# EAGLE design Rev A (EAGLE 6.5.0)

## Sheet 1 of 2: Amplifier
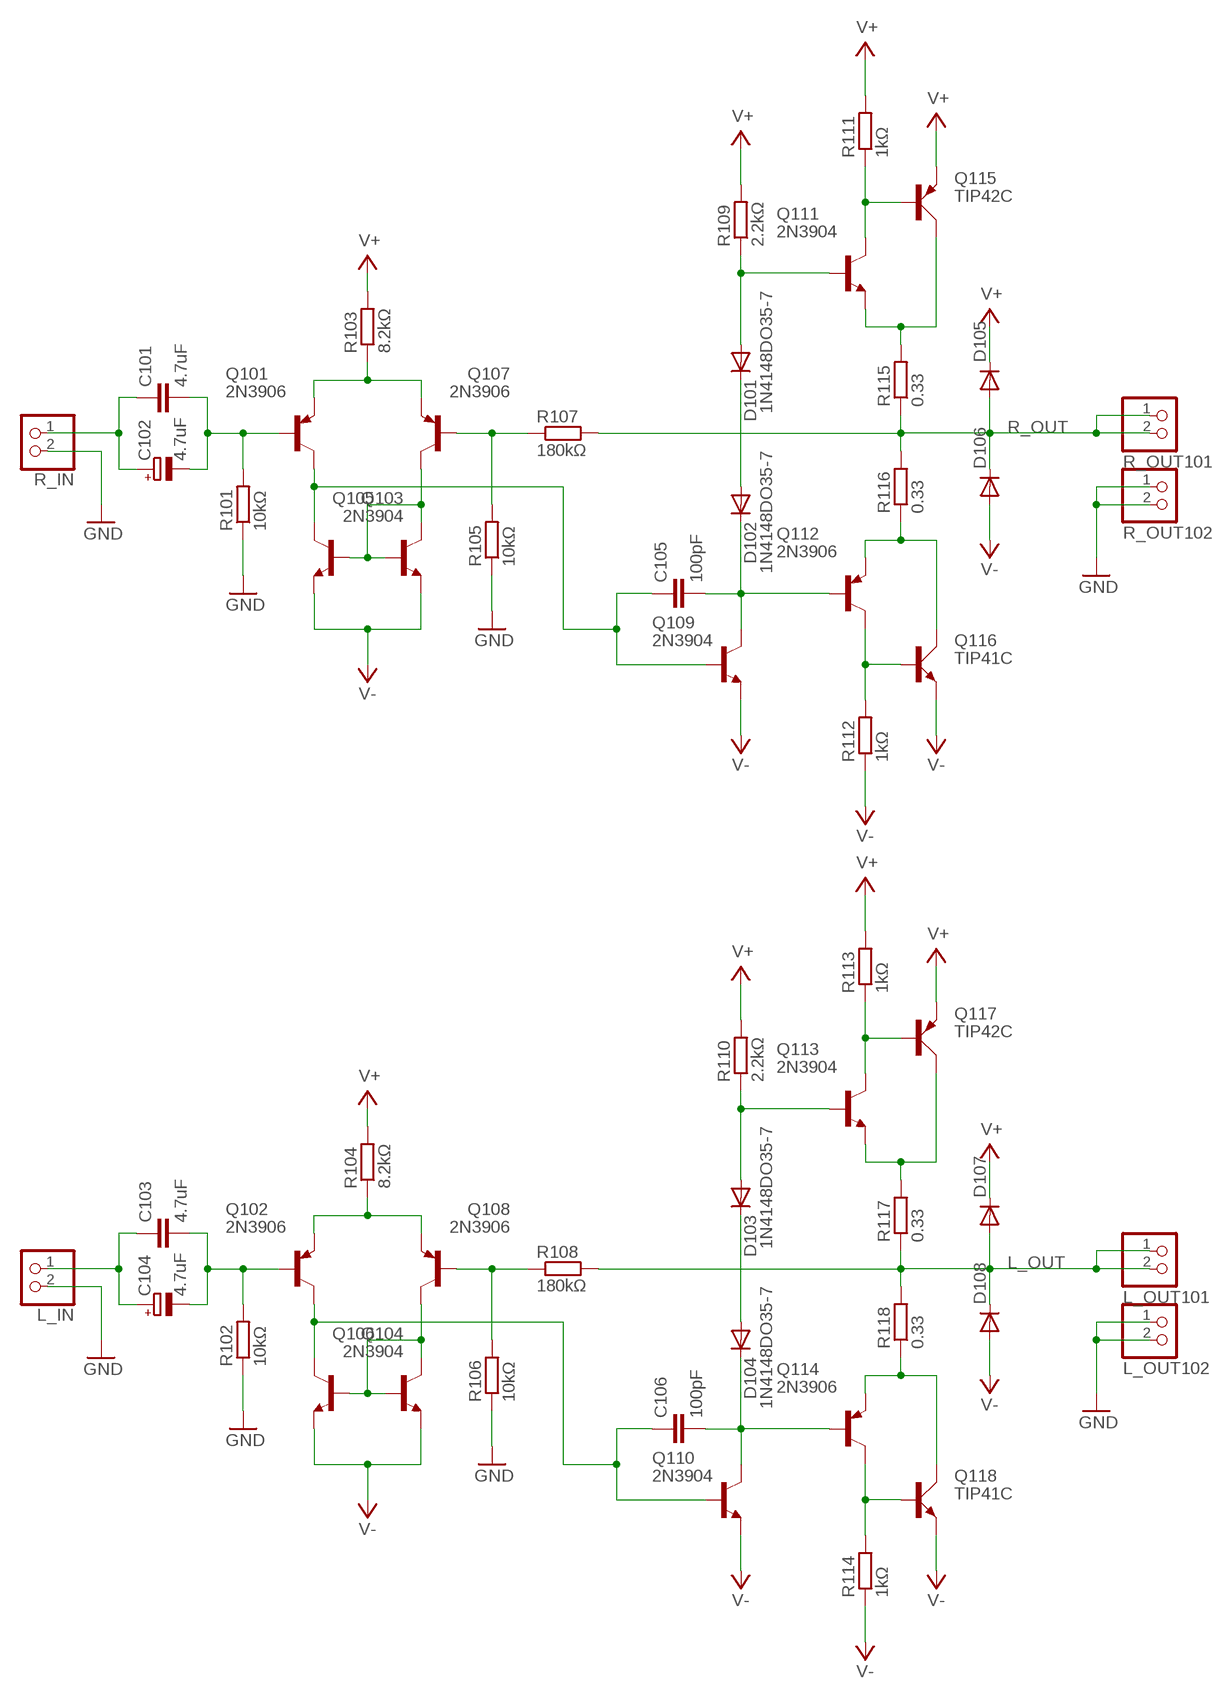
[diagram p0: schematic, sheet 1]

### Parts
C101  4.7uF  C-EU225-113X268  [C225-113X268]
C102  4.7uF  CPOL-EUE2-5  [E2-5]
C103  4.7uF  C-EU225-113X268  [C225-113X268]
C104  4.7uF  CPOL-EUE2-5  [E2-5]
C105  100pF  C-EU050-050X075  [C050-050X075]
C106  100pF  C-EU050-050X075  [C050-050X075]
D101  1N4148DO35-7  [DO35-7]
D102  1N4148DO35-7  [DO35-7]
D103  1N4148DO35-7  [DO35-7]
D104  1N4148DO35-7  [DO35-7]
D105  1N4148DO35-7  [DO35-7]
D106  1N4148DO35-7  [DO35-7]
D107  1N4148DO35-7  [DO35-7]
D108  1N4148DO35-7  [DO35-7]
L_IN  JST_2PIN-THM  [JST-PH-2-THM]
L_OUT101  JST_2PIN-THM  [JST-PH-2-THM]
L_OUT102  JST_2PIN-THM  [JST-PH-2-THM]
Q101  2N3906  [TO92]
Q102  2N3906  [TO92]
Q103  2N3904  [TO92]
Q104  2N3904  [TO92]
Q105  2N3904  [TO92]
Q106  2N3904  [TO92]
Q107  2N3906  [TO92]
Q108  2N3906  [TO92]
Q109  2N3904  [TO92]
Q110  2N3904  [TO92]
Q111  2N3904  [TO92]
Q112  2N3906  [TO92]
Q113  2N3904  [TO92]
Q114  2N3906  [TO92]
Q115  TIP42C  [TO220AV]
Q116  TIP41C  [TO220AV]
Q117  TIP42C  [TO220AV]
Q118  TIP41C  [TO220AV]
R101  10kΩ  R-EU_0207/10  [0207/10]
R102  10kΩ  R-EU_0207/10  [0207/10]
R103  8.2kΩ  R-EU_0207/10  [0207/10]
R104  8.2kΩ  R-EU_0207/10  [0207/10]
R105  10kΩ  R-EU_0207/10  [0207/10]
R106  10kΩ  R-EU_0207/10  [0207/10]
R107  180kΩ  R-EU_0207/10  [0207/10]
R108  180kΩ  R-EU_0207/10  [0207/10]
R109  2.2kΩ  R-EU_0207/10  [0207/10]
R110  2.2kΩ  R-EU_0207/10  [0207/10]
R111  1kΩ  R-EU_0207/10  [0207/10]
R112  1kΩ  R-EU_0207/10  [0207/10]
R113  1kΩ  R-EU_0207/10  [0207/10]
R114  1kΩ  R-EU_0207/10  [0207/10]
R115  0.33  R-EU_0414/15  [0414/15]
R116  0.33  R-EU_0414/15  [0414/15]
R117  0.33  R-EU_0414/15  [0414/15]
R118  0.33  R-EU_0414/15  [0414/15]
R_IN  JST_2PIN-THM  [JST-PH-2-THM]
R_OUT101  JST_2PIN-THM  [JST-PH-2-THM]
R_OUT102  JST_2PIN-THM  [JST-PH-2-THM]

### Nets
GND: L_IN.2 L_OUT102.1 L_OUT102.2 R101.1 R102.1 R105.1 R106.1 R_IN.2 R_OUT102.1 R_OUT102.2 ; also sheet 2
L_OUT: D107.A D108.C L_OUT101.1 L_OUT101.2 R108.2 R117.1 R118.2
N$1: D101.A Q111.2(B) R109.1
N$2: Q101.3(E) Q107.3(E) R103.1
N$3: Q103.2(B) Q105.1(C) Q105.2(B) Q107.1(C)
N$4: Q104.2(B) Q106.1(C) Q106.2(B) Q108.1(C)
N$5: C101.2 C102.- Q101.2(B) R101.2
N$6: C101.1 C102.+ R_IN.1
N$8: C105.1 Q101.1(C) Q103.1(C) Q109.2(B)
N$24: D101.C D102.A
N$25: C103.2 C104.- Q102.2(B) R102.2
N$26: Q111.1(C) Q115.B R111.1
N$27: Q112.1(C) Q116.B R112.2
N$28: Q112.3(E) Q116.C R116.1
N$29: Q111.3(E) Q115.C R115.2
N$30: C103.1 C104.+ L_IN.1
N$31: C105.2 D102.C Q109.1(C) Q112.2(B)
N$32: Q107.2(B) R105.2 R107.1
N$33: Q102.3(E) Q108.3(E) R104.1
N$34: C106.1 Q102.1(C) Q104.1(C) Q110.2(B)
N$35: D103.C D104.A
N$36: D103.A Q113.2(B) R110.1
N$37: Q113.1(C) Q117.B R113.1
N$38: Q113.3(E) Q117.C R117.2
N$39: Q114.1(C) Q118.B R114.2
N$40: Q114.3(E) Q118.C R118.1
N$41: C106.2 D104.C Q110.1(C) Q114.2(B)
N$42: Q108.2(B) R106.2 R108.1
R_OUT: D105.A D106.C R107.2 R115.1 R116.2 R_OUT101.1 R_OUT101.2
V+: D105.C D107.C Q115.E Q117.E R103.2 R104.2 R109.2 R110.2 R111.2 R113.2 ; also sheet 2
V-: D106.A D108.A Q103.3(E) Q104.3(E) Q105.3(E) Q106.3(E) Q109.3(E) Q110.3(E) Q116.E Q118.E R112.1 R114.1 ; also sheet 2

## Sheet 2 of 2: Power Supply
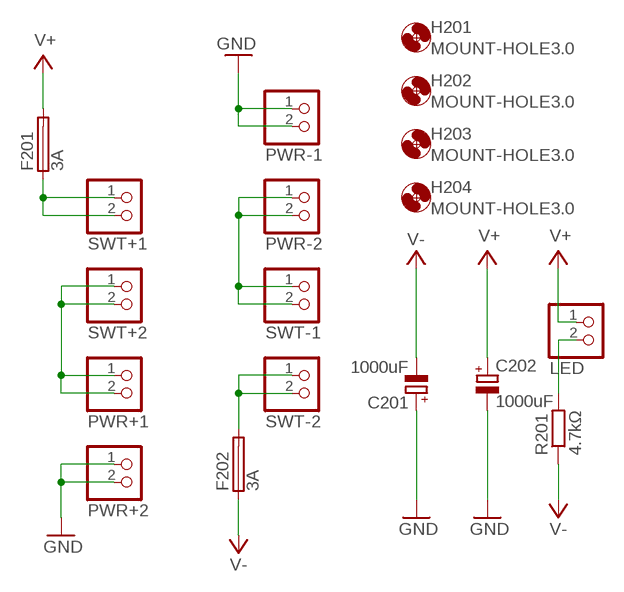
[diagram p1: schematic, sheet 2]

### Parts
C201  1000uF  CPOL-EUE5-10.5  [E5-10,5]
C202  1000uF  CPOL-EUE5-10.5  [E5-10,5]
F201  3A  SH22,5  [SH22,5]
F202  3A  SH22,5  [SH22,5]
H201  MOUNT-HOLE3.0  [3,0]
H202  MOUNT-HOLE3.0  [3,0]
H203  MOUNT-HOLE3.0  [3,0]
H204  MOUNT-HOLE3.0  [3,0]
LED  JST_2PIN-THM  [JST-PH-2-THM]
PWR+1  JST_2PIN-THM  [JST-PH-2-THM]
PWR+2  JST_2PIN-THM  [JST-PH-2-THM]
PWR-1  JST_2PIN-THM  [JST-PH-2-THM]
PWR-2  JST_2PIN-THM  [JST-PH-2-THM]
R201  4.7kΩ  R-EU_0207/10  [0207/10]
SWT+1  JST_2PIN-THM  [JST-PH-2-THM]
SWT+2  JST_2PIN-THM  [JST-PH-2-THM]
SWT-1  JST_2PIN-THM  [JST-PH-2-THM]
SWT-2  JST_2PIN-THM  [JST-PH-2-THM]

### Nets
GND: C201.+ C202.- PWR+2.1 PWR+2.2 PWR-1.1 PWR-1.2 ; also sheet 1
N$22: LED.2 R201.2
N$43: PWR+1.1 PWR+1.2 SWT+2.1 SWT+2.2
N$44: PWR-2.1 PWR-2.2 SWT-1.1 SWT-1.2
N$45: F202.2 SWT-2.1 SWT-2.2
N$47: F201.1 SWT+1.1 SWT+1.2
V+: C202.+ F201.2 LED.1 ; also sheet 1
V-: C201.- F202.1 R201.1 ; also sheet 1

## Library data of the parts
C101 C103 C105 C106 = rcl:C-EU: CAPACITOR, European symbol
C102 C104 C201 C202 = rcl:CPOL-EU: POLARIZED CAPACITOR, European symbol
D101-D108 = diode:1N4148: DIODE high speed (Philips)
F201 F202 = fuse:SH22,5: FUSE HOLDER grid 22,5 mm, OGN0031 8201, Schurter (Buerklin); MF: SCHURTER; MPN: 0031.8201; OC_FARNELL: 1162740; OC_NEWARK: 96F8317
H201-H204 = holes:MOUNT-HOLE: MOUNTING HOLE with drill center marker
L_IN L_OUT101 L_OUT102 LED PWR+1 PWR+2 PWR-1 PWR-2 R_IN R_OUT101 R_OUT102 SWT+1 SWT+2 SWT-1 SWT-2 = adafruit:JST_2PIN: JST 2-Pin Connectors of various flavors SMT-RA (S2B-PH-SM4) 4UConnector #17311 SMT (B2B-PH-SM4) THM-RA (S2B-PH) THM (B2B-PH)
Q101 Q102 Q107 Q108 Q112 Q114 = transistor-pnp:2N3906: PNP Transistor
Q103-Q106 Q109-Q111 Q113 = transistor-npn:2N3904: NPN Transistor
Q115 Q117 = transistor-power:TIP42C: PNP TRANSISTOR
Q116 Q118 = transistor-power:TIP41C: NPN TRANSISTOR
R101-R118 R201 = rcl:R-EU_: RESISTOR, European symbol

## Board
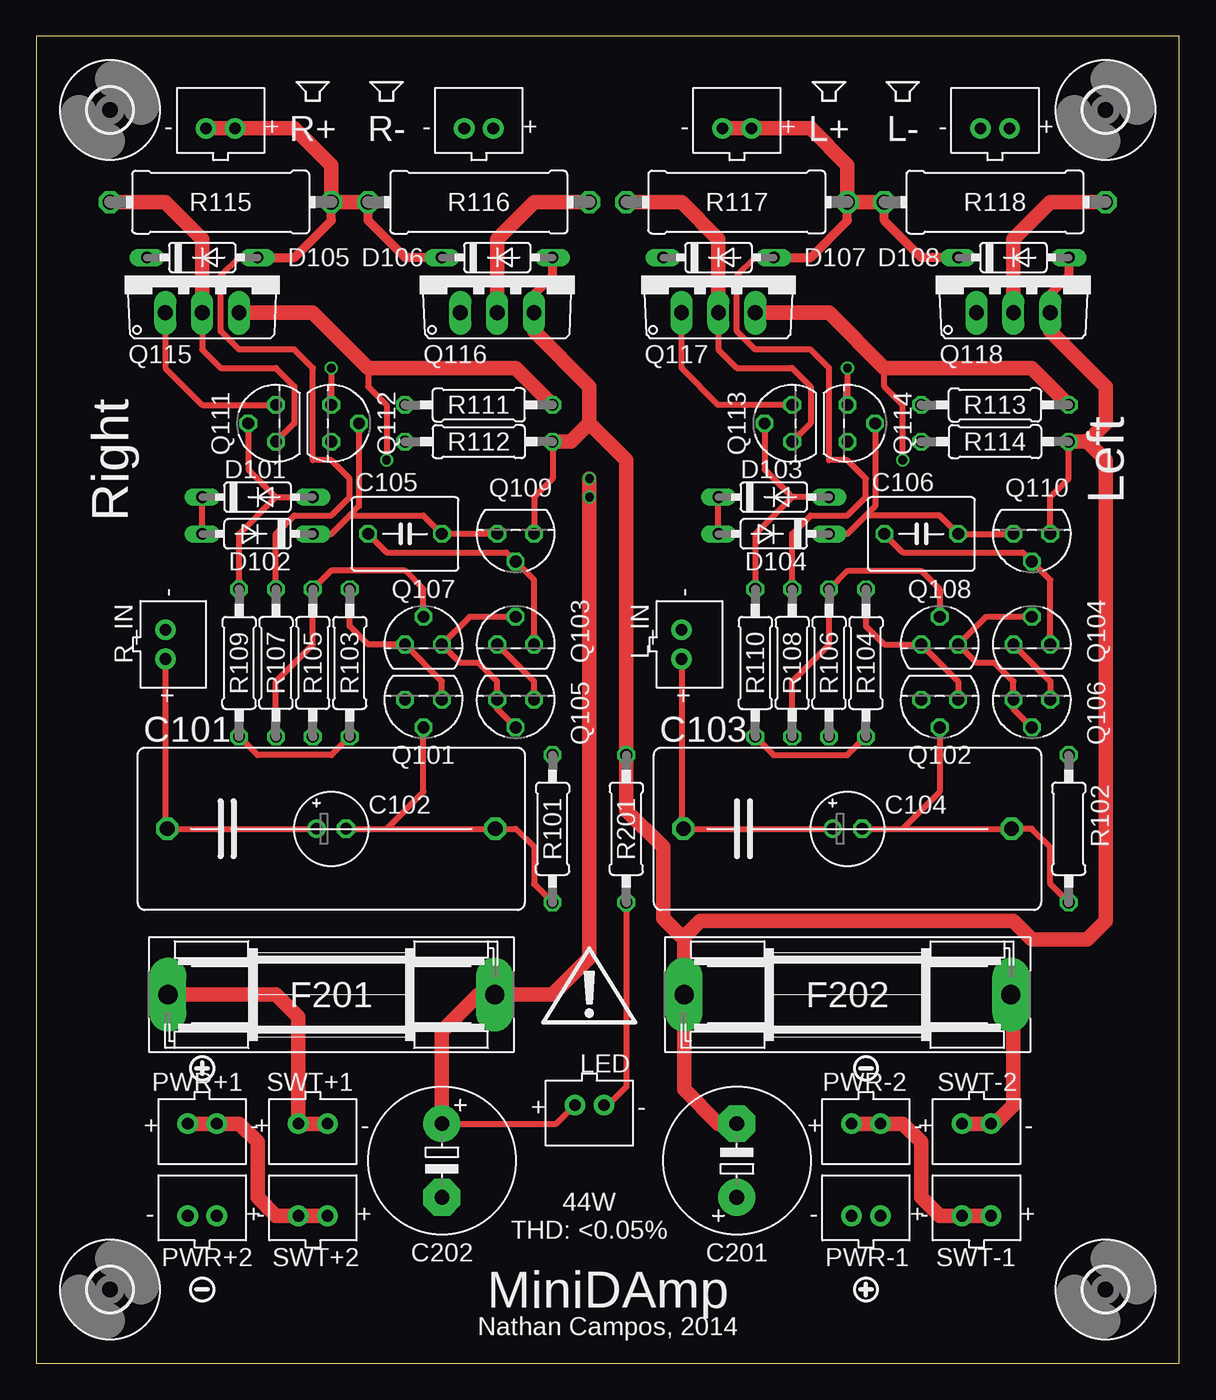
[diagram p2: board, top side]
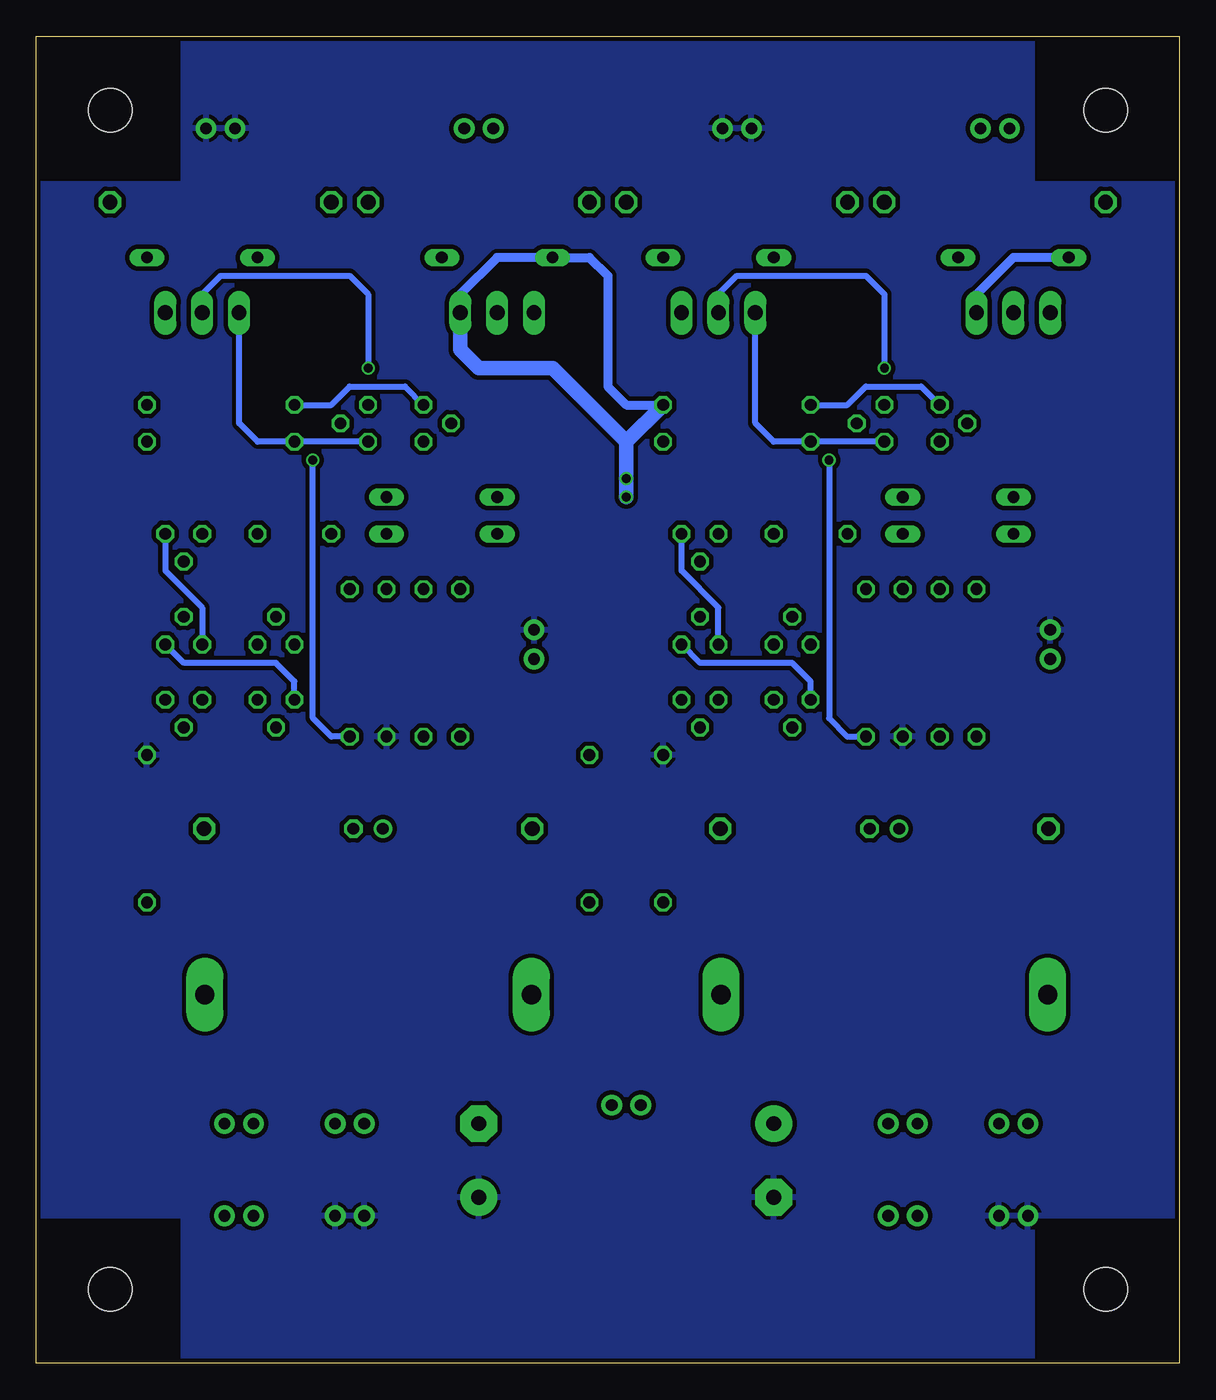
[diagram p3: board, bottom side, seen from below]

Size 78.74 x 91.44 mm. Coordinates in mm from the lower left corner, seen from the top.
Outline: 0,0 78.74,0 78.74,91.44 0,91.44 0,0
Copper layers (1*2*15*16): Top 0.035mm / dielectric 0.2mm / Route2 0.0175mm / dielectric 1.1mm / Route15 0.0175mm / dielectric 0.2mm / Bottom 0.035mm
Design rules "SeeedStudio_DRU_no_angle_20130527": minimum track width 6mil, minimum drill 12mil, track to track 6mil, track to pad 6mil, pad to pad 6mil, via to via 6mil, smd to smd 0mil, copper to edge 10mil, drill to drill 10mil, minimum pad ring 6mil, minimum via ring 6mil, stop-mask expansion 2mil, vias tented up to drill 25mil, thermal gap 10mil

### Footprints (pad centres in the part's own frame; a part is rotated, then mirrored left to right if it is on the bottom)
C225-113X268 = drill 1.016 octagon: 1 -11.303,0; 2 11.303,0
E2-5 = drill 0.813 pad 1.27: + -1.016,0 | drill 0.813 pad 1.27 octagon: - 1.016,0
C050-050X075 = drill 0.813 octagon: 1 -2.54,0; 2 2.54,0
E5-10,5 = drill 1.016 pad 2.54: + -2.54,0 | drill 1.016 pad 2.54 octagon: - 2.54,0
DO35-7 = drill 0.813 long: A 3.81,0; C -3.81,0
SH22,5 = drill 1.321 pad 2.54 long: 1 -11.252,0; 2 11.252,0
3,0 = hole 3: 0,0
JST-PH-2-THM = drill 0.8 pad 1.422: 1 1,0; 2 -1,0
TO92 = drill 0.813 octagon: 1 1.27,0; 2 0,1.905; 3 -1.27,0
TO220AV = drill 1.016 long: B -2.54,-2.54; C 0,-2.54; E 2.54,-2.54
0207/10 = drill 0.813 octagon: 1 -5.08,0; 2 5.08,0
0414/15 = drill 1.016 octagon: 1 -7.62,0; 2 7.62,0

### Placement (x,y rotation side)
C101  20.32,36.83 0 top
C102  20.32,36.83 0 top
C103  55.88,36.83 0 top
C104  55.88,36.83 0 top
C105  25.4,57.15 0 top
C106  60.96,57.15 0 top
C201  48.26,13.97 90 top
C202  27.94,13.97 270 top
D101  15.24,59.69 0 top
D102  15.24,57.15 180 top
D103  50.8,59.69 0 top
D104  50.8,57.15 180 top
D105  11.43,76.2 0 top
D106  31.75,76.2 0 top
D107  46.99,76.2 0 top
D108  67.31,76.2 0 top
F201  20.32,25.4 0 top
F202  55.88,25.4 0 top
H201  5.08,86.36 0 top
H202  5.08,5.08 0 top
H203  73.66,86.36 0 top
H204  73.66,5.08 0 top
L_IN  44.45,49.53 270 top
L_OUT101  48.26,85.09 0 top
L_OUT102  66.04,85.09 0 top
LED  38.1,17.78 180 top
PWR+1  11.43,16.51 180 top
PWR+2  11.43,10.16 0 top
PWR-1  57.15,10.16 0 top
PWR-2  57.15,16.51 180 top
Q101  26.67,45.72 180 top
Q102  62.23,45.72 180 top
Q103  33.02,49.53 0 top
Q104  68.58,49.53 0 top
Q105  33.02,45.72 180 top
Q106  68.58,45.72 180 top
Q107  26.67,49.53 0 top
Q108  62.23,49.53 0 top
Q109  33.02,57.15 180 top
Q110  68.58,57.15 180 top
Q111  16.51,64.77 90 top
Q112  20.32,64.77 270 top
Q113  52.07,64.77 90 top
Q114  55.88,64.77 270 top
Q115  11.43,74.93 0 top
Q116  31.75,74.93 0 top
Q117  46.99,74.93 0 top
Q118  67.31,74.93 0 top
R101  35.56,36.83 270 top
R102  71.12,36.83 270 top
R103  21.59,48.26 270 top
R104  57.15,48.26 270 top
R105  19.05,48.26 90 top
R106  54.61,48.26 90 top
R107  16.51,48.26 90 top
R108  52.07,48.26 90 top
R109  13.97,48.26 270 top
R110  49.53,48.26 270 top
R111  30.48,66.04 0 top
R112  30.48,63.5 180 top
R113  66.04,66.04 0 top
R114  66.04,63.5 180 top
R115  12.7,80.01 180 top
R116  30.48,80.01 180 top
R117  48.26,80.01 180 top
R118  66.04,80.01 180 top
R201  40.64,36.83 270 top
R_IN  8.89,49.53 270 top
R_OUT101  12.7,85.09 0 top
R_OUT102  30.48,85.09 0 top
SWT+1  19.05,16.51 180 top
SWT+2  19.05,10.16 0 top
SWT-1  64.77,10.16 0 top
SWT-2  64.77,16.51 180 top
U$1  [ICON_EXL-S]  38.1,25.4 0 top
U$2  [ICON_MINUS]  11.43,5.08 0 top
U$3  [ICON_MINUS]  57.15,20.32 0 top
U$4  [ICON_PLUS]  11.43,20.32 0 top
U$5  [ICON_PLUS]  57.15,5.08 0 top
U$6  [ICON_SPEAKER]  19.05,87.63 90 top
U$7  [ICON_SPEAKER]  24.13,87.63 90 top
U$8  [ICON_SPEAKER]  54.61,87.63 90 top
U$9  [ICON_SPEAKER]  59.69,87.63 90 top

### Tracks (layer width: path | path; a pad name or v marks a point on that pad's centre or on a via)
GND
  pour Bottom (isolate 0.305): 10.16,91.44 10.16,81.28 0,81.28 0,10.16 10.16,10.16 10.16,0 68.58,0 68.58,10.16 78.74,10.16 78.74,81.28 68.58,81.28 68.58,91.44
L_OUT
  Top 0.406: R108.2 52.07,57.15 53.34,58.42 55.88,58.42 57.15,59.69 57.15,60.96 55.88,62.23 54.61,62.23 54.61,68.58 53.34,69.85 49.53,69.85 48.26,71.12 48.26,74.93 49.53,76.2 D107.A
  Top 0.61: D107.A 53.34,76.2 55.88,78.74 R117.1 | D108.C 60.96,76.2 58.42,78.74 R118.2
  Top 1.016: R118.2 R117.1 55.88,82.55 53.34,85.09 L_OUT101.1 L_OUT101.2
N$1
  Top 0.406: R109.1 13.97,57.15 16.51,59.69 | 16.51,59.69 D101.A | Q111.2 14.61,61.59 16.51,59.69
N$2
  Top 0.406: Q101.3 27.94,46.99 Q107.3 22.86,49.53 21.59,50.8 R103.1
N$3
  Top 0.406: Q105.2 31.75,45.09 Q105.1 31.75,46.99 30.48,48.26 29.21,48.26 Q107.1 29.84,51.44 Q103.2
N$4
  Top 0.406: Q106.2 67.31,45.09 Q106.1 67.31,46.99 66.04,48.26 64.77,48.26 Q108.1 65.41,51.44 Q104.2
N$5
  Top 0.406: R101.2 34.29,33.02 34.29,35.56 33.02,36.83 C101.2 C102.- 24.13,36.83 26.67,39.37 Q101.2
N$6
  Top 0.406: C102.+ C101.1 8.89,36.96 R_IN.1
N$8
  Top 0.406: C105.1 24.13,55.88 32.38,55.88 Q109.2 34.29,53.98 Q103.1
  Bottom 0.406: Q101.1 25.4,46.99 26.67,48.26 33.02,48.26 Q103.1
N$22
  Top 0.406: R201.2 40.64,19.05 39.37,17.78 LED.2
N$24
  Top 0.406: D102.A D101.C
N$25
  Top 0.406: C104.- 59.69,36.83 | 59.69,36.83 C103.2 68.58,36.83 69.85,35.56 69.85,33.02 R102.2 | Q102.2 62.23,39.37 59.69,36.83
N$26
  Top 0.406: Q115.B 8.89,68.58 11.43,66.04 Q111.1
  Bottom 0.406: R111.1 22.86,66.04 21.59,67.31 17.78,67.31 Q111.1
N$27
  Bottom 0.406: Q112.1 R112.2 27.94,63.5 29.21,64.77 Q116.B
N$28  (via drill 0.6)
  Top 0.406: v20.32,68.58 Q112.3
  Top 1.016: R116.1 34.29,80.01 31.75,77.47 Q116.C
  Bottom 0.406: Q116.C 31.75,73.66 30.48,74.93 21.59,74.93 20.32,73.66 v20.32,68.58
N$29
  Top 0.406: Q115.C 11.43,69.85 12.7,68.58 16.51,68.58 17.78,67.31 17.78,64.77 Q111.3
  Top 1.016: R115.2 8.89,80.01 11.43,77.47 Q115.C
N$30
  Top 0.406: L_IN.1 44.45,36.96 C103.1 C104.+
N$31
  Top 0.406: D102.C 20.32,57.15 21.59,58.42 | 21.59,58.42 26.67,58.42 C105.2 Q109.1 | Q112.2 22.23,59.05 21.59,58.42
N$32
  Top 0.406: Q107.2 26.67,53.34 25.4,54.61 20.32,54.61 R105.2 19.05,49.53 16.51,46.99 R107.1
N$33
  Top 0.406: R104.1 57.15,50.8 58.42,49.53 Q108.3 63.5,46.99 Q102.3
N$34
  Top 0.406: Q104.1 69.85,53.98 Q110.2 67.94,55.88 59.69,55.88 C106.1
  Bottom 0.406: Q102.1 60.96,46.99 62.23,48.26 68.58,48.26 Q104.1
N$35
  Top 0.406: D104.A D103.C
N$36
  Top 0.406: D103.A 52.07,59.69 | 52.07,59.69 49.53,57.15 R110.1 | Q113.2 50.16,61.59 52.07,59.69
N$37
  Top 0.406: Q113.1 46.99,66.04 44.45,68.58 Q117.B
  Bottom 0.406: R113.1 58.42,66.04 57.15,67.31 53.34,67.31 Q113.1
N$38
  Top 0.406: Q117.C 46.99,69.85 48.26,68.58 52.07,68.58 53.34,67.31 53.34,64.77 Q113.3
  Top 1.016: R117.2 44.45,80.01 46.99,77.47 Q117.C
N$39
  Bottom 0.406: Q114.1 R114.2 63.5,63.5 64.77,64.77 Q118.B
N$40  (via drill 0.6)
  Top 0.406: v55.88,68.58 Q114.3
  Top 1.016: R118.1 69.85,80.01 67.31,77.47 Q118.C
  Bottom 0.406: Q118.C 67.31,73.66 66.04,74.93 57.15,74.93 55.88,73.66 v55.88,68.58
N$41
  Top 0.406: Q110.1 C106.2 62.23,58.42 57.15,58.42 | Q114.2 57.78,59.05 57.15,58.42 | 57.15,58.42 55.88,57.15 D104.C
N$42
  Top 0.406: R108.1 52.07,46.99 54.61,49.53 R106.2 55.88,54.61 60.96,54.61 62.23,53.34 Q108.2
N$43
  Top 1.016: PWR+1.1 PWR+1.2 13.97,16.51 15.24,15.24 15.24,11.43 16.51,10.16 SWT+2.2 SWT+2.1
N$44
  Top 1.016: SWT-1.1 SWT-1.2 62.23,10.16 60.96,11.43 60.96,15.24 59.69,16.51 PWR-2.2 PWR-2.1
N$45
  Top 1.016: SWT-2.1 SWT-2.2 66.04,16.51 67.31,17.78 67.31,25.22 F202.2
N$47
  Top 1.016: SWT+1.2 SWT+1.1 18.05,23.86 16.51,25.4 F201.1
R_OUT
  Top 0.406: R107.2 16.51,57.15 17.78,58.42 20.32,58.42 21.59,59.69 21.59,60.96 20.32,62.23 19.05,62.23 19.05,68.58 17.78,69.85 13.97,69.85 12.7,71.12 12.7,74.93 13.97,76.2 D105.A
  Top 0.61: D105.A 17.78,76.2 20.32,78.74 R115.1 | D106.C 25.4,76.2 22.86,78.74 R116.2
  Top 1.016: R116.2 R115.1 20.32,82.55 17.78,85.09 R_OUT101.1 R_OUT101.2
V+  (via drill 0.6)
  Top 0.406: R103.2 20.32,41.91 15.24,41.91 R109.2 | 22.86,68.58 22.86,67.31 24.13,66.04 v24.13,62.23 | R110.2 50.8,41.91 55.88,41.91 R104.2 | v59.69,62.23 59.69,66.04 58.42,67.31 58.42,68.58 | C202.+ 35.83,16.51 LED.1
  Top 1.016: Q115.E 19.05,72.39 22.86,68.58 33.02,68.58 R111.2 | Q117.E 54.61,72.39 58.42,68.58 68.58,68.58 R113.2 | v38.1,60.96 v38.1,59.69 38.1,27.94 35.56,25.4 F201.2 30.48,25.4 27.94,22.86 C202.+
  Bottom 0.406: v24.13,62.23 24.13,44.45 22.86,43.18 R103.2 | R104.2 58.42,43.18 59.69,44.45 v59.69,62.23
  Bottom 0.61: D105.C 11.43,76.2 13.97,73.66 Q115.E | Q117.E 49.53,73.66 46.99,76.2 D107.C 40.64,76.2 39.37,74.93 39.37,67.31 38.1,66.04 R111.2
  Bottom 1.016: v38.1,59.69 v38.1,60.96 38.1,63.5 | 38.1,63.5 R111.2 | 38.1,63.5 43.18,68.58 48.26,68.58 49.53,69.85 Q117.E
V-
  Top 0.406: Q105.3 34.29,46.99 Q103.3 | R112.1 35.56,60.96 34.29,59.69 Q109.3 | Q104.3 69.85,46.99 Q106.3 | Q110.3 69.85,59.69 71.12,60.96 R114.1
  Top 0.61: Q116.E 34.29,73.66 35.56,74.93 D106.A | D108.A 71.12,74.93 69.85,73.66 Q118.E
  Top 1.016: Q116.E 34.29,71.12 38.1,67.31 38.1,64.77 | 38.1,64.77 36.83,63.5 R112.1 | Q118.E 69.85,71.12 73.66,67.31 73.66,64.77 72.39,63.5 | 72.39,63.5 R114.1 | 38.1,64.77 40.64,62.23 R201.1 40.64,38.1 43.18,35.56 43.18,30.66 44.63,29.21 | 44.63,29.21 F202.1 44.63,18.87 46.99,16.51 C201.- | 44.63,29.21 44.63,29.39 45.72,30.48 67.31,30.48 68.58,29.21 72.39,29.21 73.66,30.48 73.66,62.23 72.39,63.5
  Bottom 0.406: Q103.3 31.75,52.07 34.29,54.61 Q109.3 | Q110.3 69.85,54.61 67.31,52.07 Q104.3

### Text on the board
tPlace: R+ | R- | L+ | L- | Right | Left | 44W / THD: <0.05% | MiniDAmp | Nathan Campos, 2014